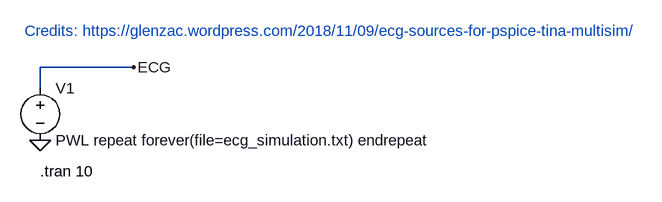
[diagram p0: schematic ecg_simulation.asc]
ecg_simulation.asc, the LTspice schematic file:
Version 4
SHEET 1 1040 680
WIRE -800 192 -944 192
WIRE -944 224 -944 192
FLAG -944 304 0
FLAG -800 192 ECG
SYMBOL voltage -944 208 R0
WINDOW 123 0 0 Left 0
WINDOW 39 0 0 Left 0
SYMATTR InstName V1
SYMATTR Value PWL repeat forever(file=ecg_simulation.txt) endrepeat
TEXT -968 136 Left 2 ;Credits: https://glenzac.wordpress.com/2018/11/09/ecg-sources-for-pspice-tina-multisim/
TEXT -944 352 Left 2 !.tran 10

The netlist it stands for:
* ecg_simulation.asc
V1 ECG 0 PWL repeat forever(file=ecg_simulation.txt) endrepeat
* Credits: https://glenzac.wordpress.com/2018/11/09/ecg-sources-for-pspice-tina-multisim/
.tran 10
.backanno
.end